# Altium schematic sheet power.SCHDOC
size B
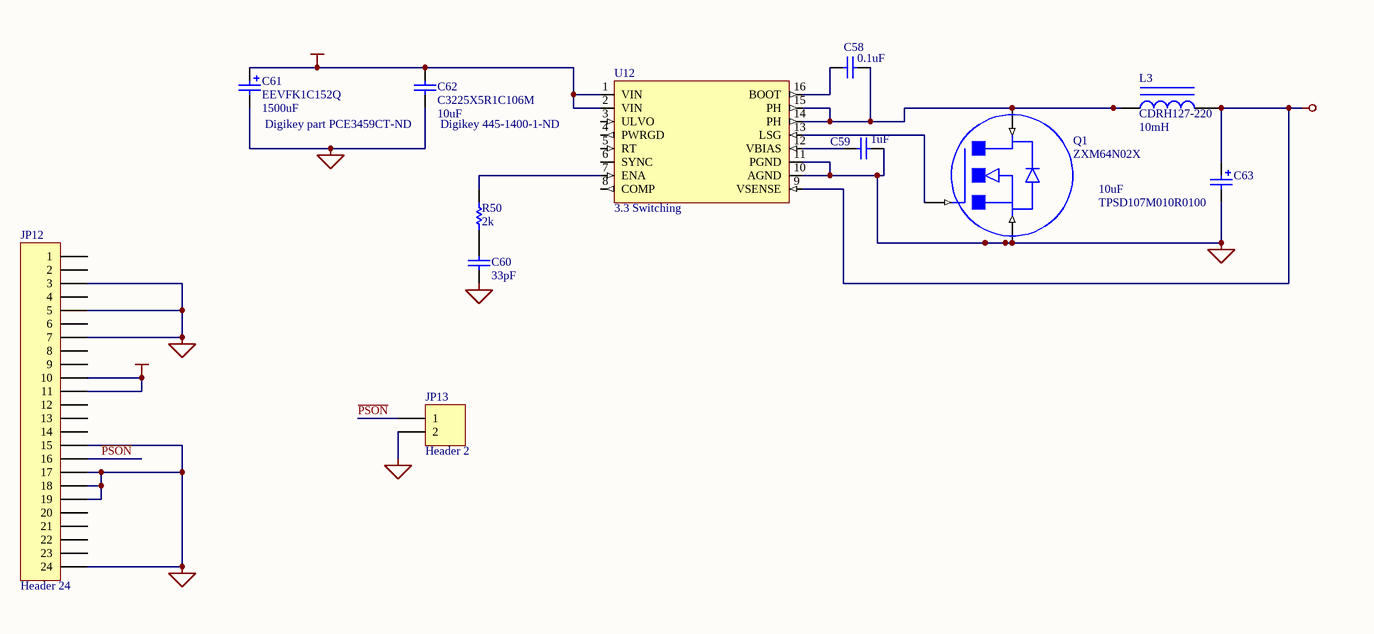
[diagram p0: power.SCHDOC]

## Parts
C58  value 0.1uF  [CC1608-0603]  (hidden comment: Cap)
C59  value 1uF  [CC1608-0603]  (hidden comment: Cap)
C60  value 33pF  [CC1608-0603]  (hidden comment: Cap)
C61  EEVFK1C152Q  value 1500uF  Manufacturer: Digikey part PCE3459CT-ND  [PanasonicE]
C62  C3225X5R1C106M  value 10uF  Manufacturer: Digikey 445-1400-1-ND  [CC3225-1210]
C63  TPSD107M010R0100  value 10uF  [TC7360-2924]
JP12  Header 24  [SFX-POWER 39-28-1243]
JP13  Header 2  [HDR1X2]
L3  CDRH127-220  value 10mH  [SUMIDA Inductor]
Q1  ZXM64N02X  [MSOP8]
R50  value 2k  [CC1608-0603]  (hidden comment: Res1)
U12  3.3 Switching  [PWP PowerPad - 16]

## Nets
+12VCC: C61.1 C62.1 JP12.10 JP12.11 U12.1(VIN) U12.2(VIN)
GND: C59.2 C60.2 C61.2 C62.2 C63.2 JP12.3 JP12.5 JP12.7 JP12.15 JP12.17 JP12.18 JP12.19 JP12.24 JP13.2 Q1.1(S) U12.10(AGND) U12.11(PGND) U12.P0(PAD) U12.P1(PAD) U12.P2(PAD) U12.P3(PAD) U12.P4(PAD) U12.P5(PAD) U12.P6(PAD) U12.P7(PAD) U12.P8(PAD) U12.P9(PAD) U12.P10(PAD) U12.P11(PAD) U12.P12(PAD) U12.P13(PAD) U12.P14(PAD) U12.P15(PAD) U12.P16(PAD) U12.P17(PAD) U12.P18(PAD)
VCC: C63.1 L3.2 U12.9(VSENSE)
~{PSON}: JP12.16 JP13.1
NetC58_1: C58.1 U12.16(BOOT)
NetC58_2: C58.2 L3.1 Q1.5(D) U12.14(PH) U12.15(PH)
NetC59_1: C59.1 U12.12(VBIAS)
NetC60_1: C60.1 R50.1
NetQ1_4: Q1.4(G) U12.13(LSG)
NetR50_2: R50.2 U12.7(ENA)

Not connected (* = marked no-connect by the designer): JP12 1 2 4 6 8 9 12 13 14 20 21 22 23; Q1 2(S) 3(S) 6(D) 7(D) 8(D); U12 3(ULVO) 4(PWRGD) 5(RT) 6(SYNC) 8(COMP)

## Library data of the parts
C58-C60 = Cap: Capacitor; Manufacturer: Generic Components; Class I: Passive; Published: 8-Jun-2000; Revision: July-2002: Re-released for DXP Platform.; Publisher: Altium Limited; Class II: Capacitor
C61 = Cap Pol1: Input Bulk Cap; Class I: Passive; Class II: Capacitor; Published: 8-Jun-2000; Revision: July-2002: Re-released for DXP Platform.; Publisher: Altium Limited
C62 = Cap: Input Bypass Cap; Class I: Passive; Class II: Capacitor; Published: 8-Jun-2000; Revision: July-2002: Re-released for DXP Platform.; Publisher: Altium Limited
C63 = Cap Pol1: Polarized Capacitor (Radial); Manufacturer: Generic Components; Class I: Passive; Published: 8-Jun-2000; Revision: July-2002: Re-released for DXP Platform.; Publisher: Altium Limited; Class II: Capacitor
JP12 = Header 24: Header, 24-Pin; Manufacturer: Generic Components; Class I: Connector; Revision: July-2002: Re-released for DXP Platform.; Publisher: Altium Limited
JP13 = Header 2: Header, 2-Pin; Manufacturer: Generic Components; Class I: Connector; Revision: July-2002: Re-released for DXP Platform.; Publisher: Altium Limited
L3 = Inductor Iron: Magnetic-Core Inductor; Manufacturer: Generic Components; Class I: Passive; Published: 24-Mar-1999; Revision: July-2002: Re-released for DXP Platform.; Publisher: Altium Limited; Class II: Inductor
Q1 = N-CHAN ENH MOSFET
R50 = Res1: Resistor; Manufacturer: Generic Components; Class I: Passive; Published: 8-Jun-2000; Revision: July-2002: Re-released for DXP Platform.; Publisher: Altium Limited; Class II: Resistor
U12 = TPS54356: TI 3A 3.3V out switching Regulator